# EAGLE schematic power_bus (EAGLE 7.5.0)
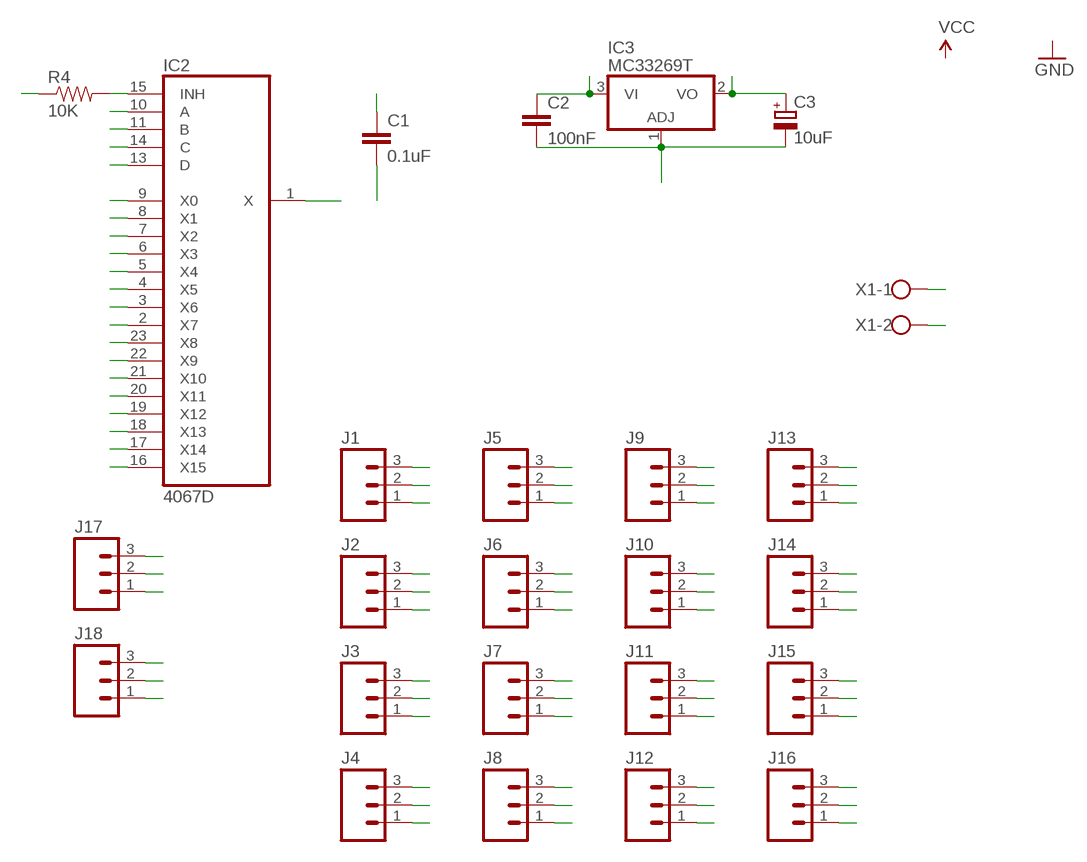
[diagram p0: schematic, sheet 1]

## Parts
C1  0.1uF  CAPEZ  [CAP-PTH-SMALLEZ]
C2  100nF  CAPEZ  [CAP-PTH-SMALLEZ]
C3  10uF  CPOL-EUE5-4  [E5-4]
IC2  4067D  [SO24W]
IC3  MC33269T  [TO220V]
J1  M03JST-PTH-VERT  [JST-3-PTH-VERT]
J2  M03JST-PTH-VERT  [JST-3-PTH-VERT]
J3  M03JST-PTH-VERT  [JST-3-PTH-VERT]
J4  M03JST-PTH-VERT  [JST-3-PTH-VERT]
J5  M03JST-PTH-VERT  [JST-3-PTH-VERT]
J6  M03JST-PTH-VERT  [JST-3-PTH-VERT]
J7  M03JST-PTH-VERT  [JST-3-PTH-VERT]
J8  M03JST-PTH-VERT  [JST-3-PTH-VERT]
J9  M03JST-PTH-VERT  [JST-3-PTH-VERT]
J10  M03JST-PTH-VERT  [JST-3-PTH-VERT]
J11  M03JST-PTH-VERT  [JST-3-PTH-VERT]
J12  M03JST-PTH-VERT  [JST-3-PTH-VERT]
J13  M03JST-PTH-VERT  [JST-3-PTH-VERT]
J14  M03JST-PTH-VERT  [JST-3-PTH-VERT]
J15  M03JST-PTH-VERT  [JST-3-PTH-VERT]
J16  M03JST-PTH-VERT  [JST-3-PTH-VERT]
J17  M03PTH  [1X03]
J18  M03PTH  [1X03]
R4  10K  RESISTORAXIAL-0.3  [AXIAL-0.3]
X1  W237-102  [W237-102]

## Nets
MUX0: IC2.9(X0) J1.3
MUX1: IC2.8(X1) J2.3
MUX2: IC2.7(X2) J3.3
MUX3: IC2.6(X3) J4.3
MUX4: IC2.5(X4) J5.3
MUX5: IC2.4(X5) J6.3
MUX6: IC2.3(X6) J7.3
MUX7: IC2.2(X7) J8.3
MUX8: IC2.23(X8) J9.3
MUX9: IC2.22(X9) J10.3
MUX10: IC2.21(X10) J11.3
MUX11: IC2.20(X11) J12.3
MUX12: IC2.19(X12) J13.3
MUX13: IC2.18(X13) J14.3
MUX14: IC2.17(X14) J15.3
MUX15: IC2.16(X15) J16.3
MUX_A: IC2.10(A) J17.1
MUX_B: IC2.11(B) J18.1
MUX_C: IC2.14(C) J18.3
MUX_D: IC2.13(D) J17.3
MUX_X: IC2.1(X) J17.2
N$2: IC2.15(INH) R4.P$2
VDD: C1.1 C3.+ IC3.2(VO) J1.1 J2.1 J3.1 J4.1 J5.1 J6.1 J7.1 J8.1 J9.1 J10.1 J11.1 J12.1 J13.1 J14.1 J15.1 J16.1
VOLTAGE: C2.1 IC3.3(VI) X1.1
VSS: C1.2 C2.2 C3.- IC3.1(ADJ) J1.2 J2.2 J3.2 J4.2 J5.2 J6.2 J7.2 J8.2 J9.2 J10.2 J11.2 J12.2 J13.2 J14.2 J15.2 J16.2 J18.2 R4.P$1 X1.2

## Power pins joined to a net without a drawn wire
VDD: IC2.24(VDD)
VSS: IC2.12(VSS)

## Library data of the parts
C1 C2 = SparkFun-Capacitors:CAP: Capacitor Standard 0603 ceramic capacitor, and 0.1" leaded capacitor.
C3 = rcl:CPOL-EU: POLARIZED CAPACITOR, European symbol
IC2 = 40xx:4067: 16-channel ANALOG MULTIPLEXER
IC3 = linear:MC33269?*: Adjustable Output Low Dropout Voltage Regulator 800 mA Source: http://www.onsemi.com/pub/Collateral/MC33269-D.PDF
J1-J18 = SparkFun-Connectors:M03: Header 3 Standard 3-pin 0.1" header. Use with straight break away headers (SKU : PRT-00116), right angle break away headers (PRT-00553), swiss pins (PRT-00743), machine pins (PRT-00117), and female headers (PRT-00115). Molex polarized connector foot print use with SKU : PRT-08232 with associated crimp pins and housings.
R4 = SparkFun-Passives:RESISTOR: Resistor Basic schematic elements and footprints for 0603, 1206, and PTH resistors.
X1 = con-wago-500:W237-102: WAGO SCREW CLAMP; MPN: 237-102; OC_FARNELL: unknown; OC_NEWARK: 70K9898